# EAGLE schematic macaron (EAGLE 6.5.0)
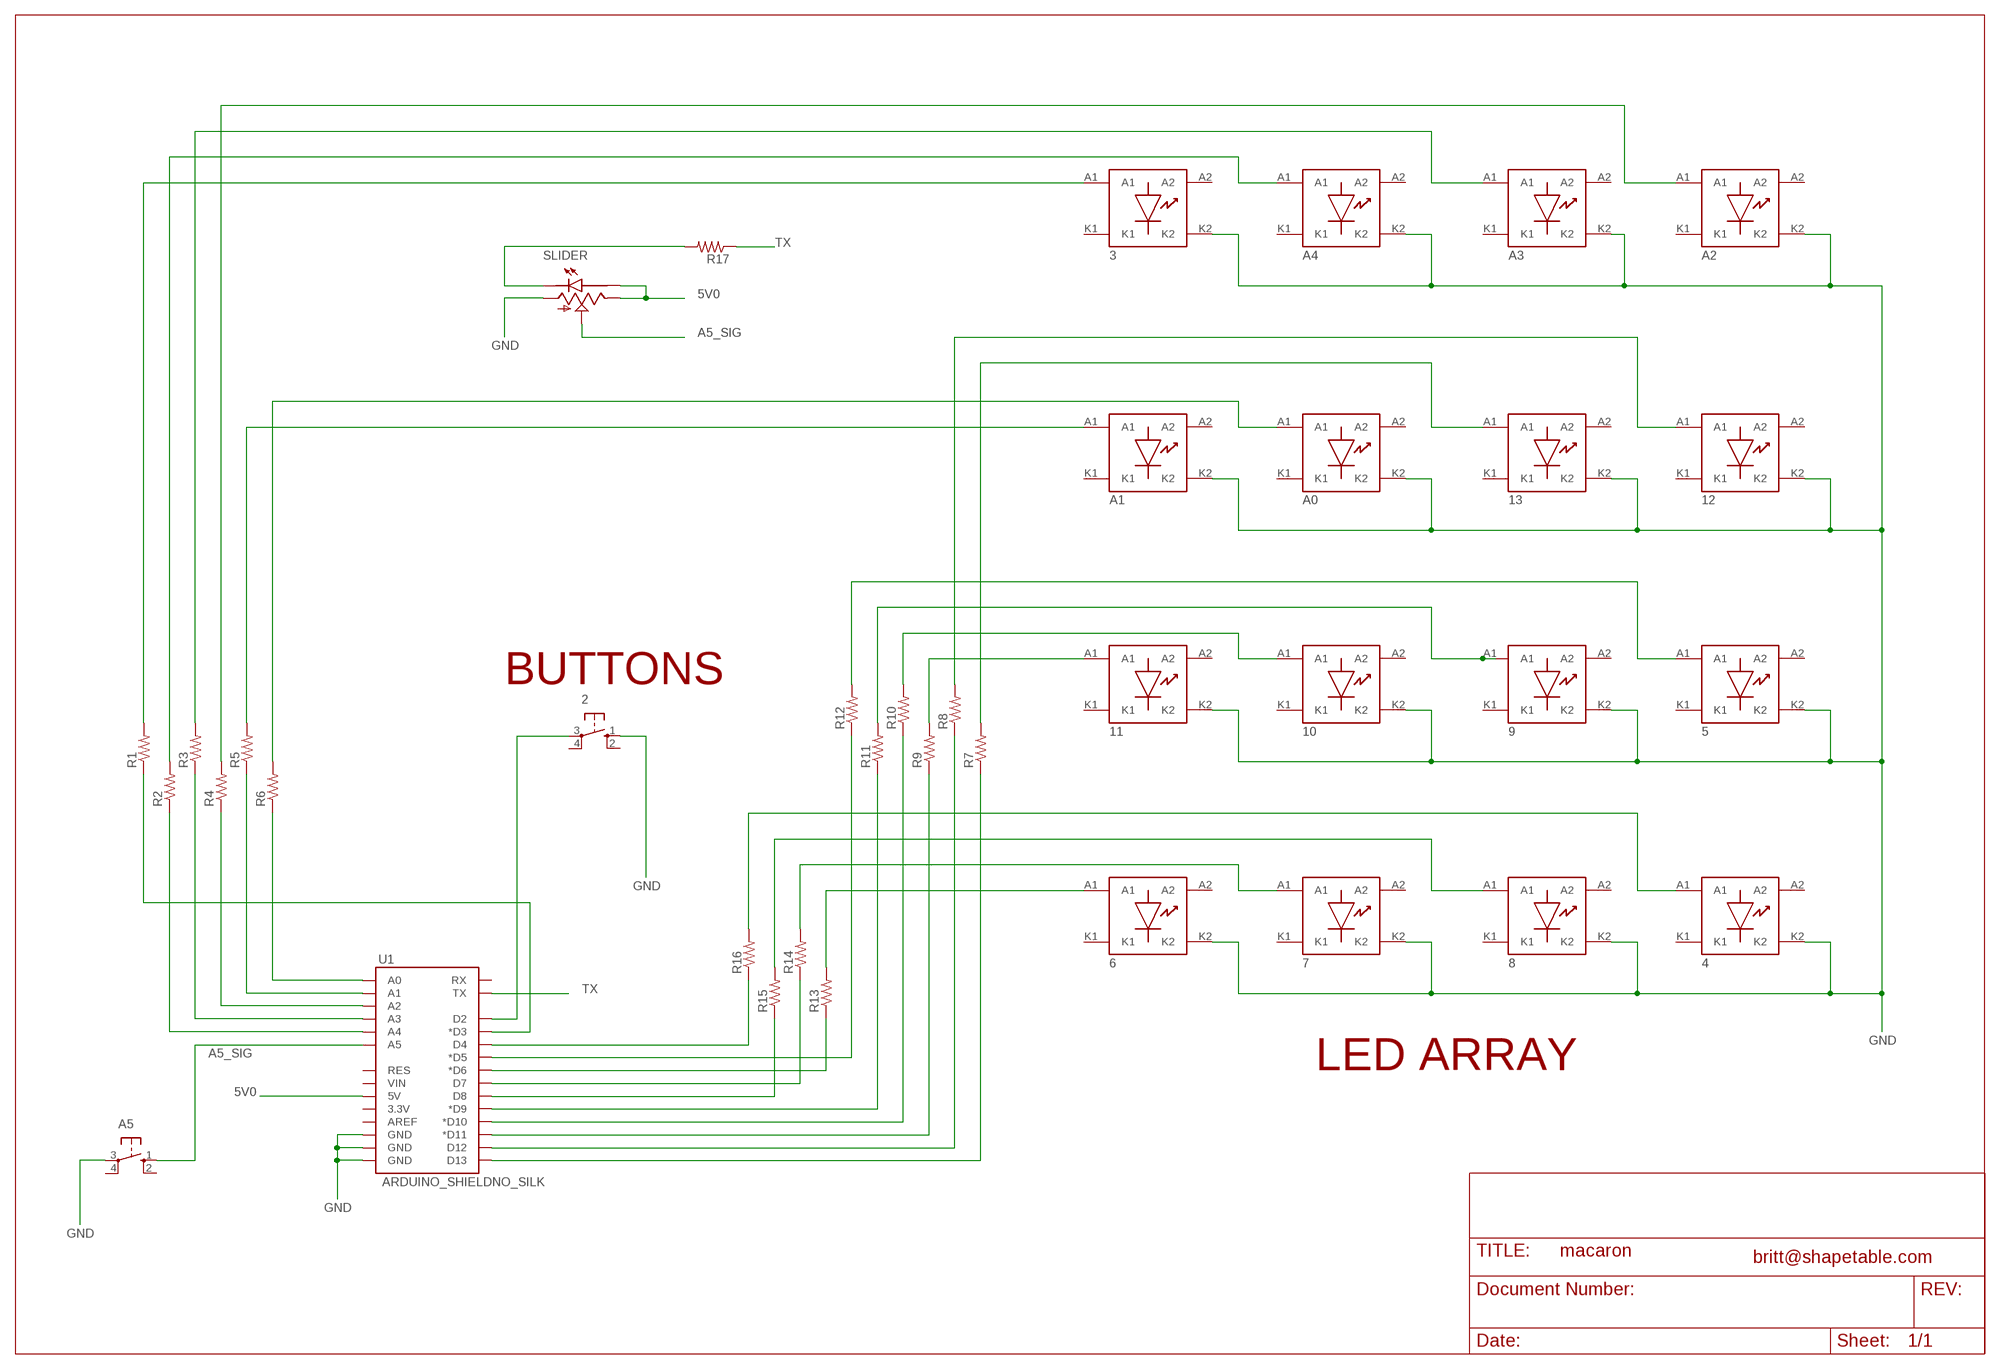
[diagram p0: schematic, sheet 1]

## Parts
2  10-XX  [B3F-10XX]
3  LED_SMT  [AVAGO-SMT-LED]
4  LED_SMT  [AVAGO-SMT-LED]
5  LED_SMT  [AVAGO-SMT-LED]
6  LED_SMT  [AVAGO-SMT-LED]
7  LED_SMT  [AVAGO-SMT-LED]
8  LED_SMT  [AVAGO-SMT-LED]
9  LED_SMT  [AVAGO-SMT-LED]
10  LED_SMT  [AVAGO-SMT-LED]
11  LED_SMT  [AVAGO-SMT-LED]
12  LED_SMT  [AVAGO-SMT-LED]
13  LED_SMT  [AVAGO-SMT-LED]
A0  LED_SMT  [AVAGO-SMT-LED]
A1  LED_SMT  [AVAGO-SMT-LED]
A2  LED_SMT  [AVAGO-SMT-LED]
A3  LED_SMT  [AVAGO-SMT-LED]
A4  LED_SMT  [AVAGO-SMT-LED]
A5  10-XX  [B3F-10XX]
R1  R-US_0204/7  [0204/7]
R2  R-US_0204/7  [0204/7]
R3  R-US_0204/7  [0204/7]
R4  R-US_0204/7  [0204/7]
R5  R-US_0204/7  [0204/7]
R6  R-US_0204/7  [0204/7]
R7  R-US_0204/7  [0204/7]
R8  R-US_0204/7  [0204/7]
R9  R-US_0204/7  [0204/7]
R10  R-US_0204/7  [0204/7]
R11  R-US_0204/7  [0204/7]
R12  R-US_0204/7  [0204/7]
R13  R-US_0204/7  [0204/7]
R14  R-US_0204/7  [0204/7]
R15  R-US_0204/7  [0204/7]
R16  R-US_0204/7  [0204/7]
R17  R-US_0204/7  [0204/7]
SLIDER  BOURNS_LED_SLIDER  [BOURNS_45MM_LED_SLIDE_POT]
U1  ARDUINO_SHIELDNO_SILK  [DUEMILANOVE_VIAS]

## Nets
5V0: SLIDER.HIGH_END(HIGH) SLIDER.LED+(A1) U1.5V
A5_SIG: A5.1(S) SLIDER.WIPER U1.A5
GND: 2.1(S) 3.K2 4.K2 5.K2 6.K2 7.K2 8.K2 9.K2 10.K2 11.K2 12.K2 13.K2 A0.K2 A1.K2 A2.K2 A3.K2 A4.K2 A5.3(P) SLIDER.LOW_END(LOW) U1.GND@0(GND) U1.GND@1(GND) U1.GND@2(GND)
N$1: R17.2 SLIDER.LED-(C)
N$2: 3.A1 R1.2
N$3: R2.1 U1.A4
N$4: A4.A1 R2.2
N$5: R3.1 U1.A3
N$6: A3.A1 R3.2
N$7: R4.1 U1.A2
N$8: A2.A1 R4.2
N$9: R5.1 U1.A1
N$10: R6.1 U1.A0
N$11: A1.A1 R5.2
N$12: A0.A1 R6.2
N$13: R7.1 U1.D13
N$14: R8.1 U1.D12
N$15: R9.1 U1.D11(*D11)
N$16: R10.1 U1.D10(*D10)
N$17: R11.1 U1.D9(*D9)
N$18: 13.A1 R7.2
N$19: 12.A1 R8.2
N$20: 11.A1 R9.2
N$21: 10.A1 R10.2
N$22: 9.A1 R11.2
N$23: R12.1 U1.D5(*D5)
N$24: R13.1 U1.D6(*D6)
N$25: R14.1 U1.D7
N$26: R15.1 U1.D8
N$27: R16.1 U1.D4
N$28: 5.A1 R12.2
N$29: 6.A1 R13.2
N$30: 7.A1 R14.2
N$31: 8.A1 R15.2
N$32: 4.A1 R16.2
N$34: 2.3(P) U1.D2
N$35: R1.1 U1.D3(*D3)
TX: R17.1 U1.TX
Unconnected: 2.2(S1) 2.4(P1) 3.A2 3.K1 4.A2 4.K1 5.A2 5.K1 6.A2 6.K1 7.A2 7.K1 8.A2 8.K1 9.A2 9.K1 10.A2 10.K1 11.A2 11.K1 12.A2 12.K1 13.A2 13.K1 A0.A2 A0.K1 A1.A2 A1.K1 A2.A2 A2.K1 A3.A2 A3.K1 A4.A2 A4.K1 A5.2(S1) A5.4(P1) U1.3.3V U1.AREF U1.RES U1.RX U1.VIN

## Notes on the sheet
- BUTTONS
- LED ARRAY
- britt@shapetable.com

## Library data of the parts
2 A5 = switch-omron:10-XX: OMRON SWITCH; MPN: B3F-1000; OC_FARNELL: 176432; OC_NEWARK: 36M3542
3-13 A0 A1-A4 = led_avago_smt_joe:LED_SMT
R1-R17 = rcl:R-US_: RESISTOR, American symbol
SLIDER = pot_bourns_joe:BOURNS_LED_SLIDER
U1 = modified_sparkfun_joe:ARDUINO_SHIELD: Arduino shield footprint